# EAGLE design Grove - Barometer Sensor V0.9b (EAGLE 6.1)
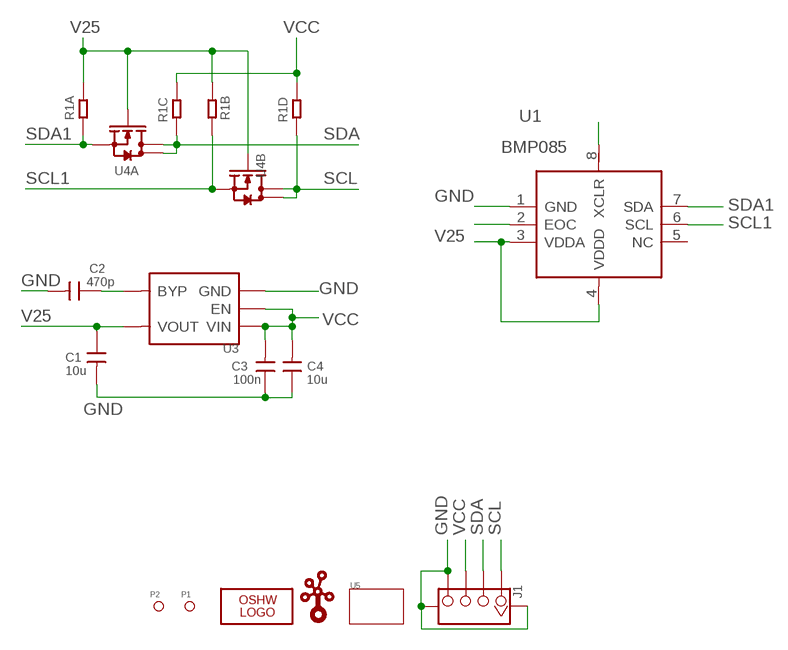
[diagram p0: schematic, sheet 1]

## Parts
C1  10u  C-0603  [0603]
C2  470p  C-0603  [0603]
C3  100n  C-0603  [0603]
C4  10u  C-0603  [0603]
J1  TWIG-4P-2.0-SMD-FEMALE-REINFORCE'DD'  [4P-SMD-2.0]
LOGO2  LOGO-OSHW-FILLX0200-NT  [OSHW_FILLX200_NOTEXT]
P1  PAD-MARK  [ROUND-MARK-0.635]
P2  PAD-MARK  [ROUND-MARK-0.635]
R1  R-4R-1206  [1206-8-3.3X2.4]
U1  BMP085  [LCC8]
U3  MIC5205  [SOT23-5]
U4  MOSFET-DUAL-N-1206-8  [1206-8]
U5  TWIG-1U  [1U-DIM-W/-DRILL]
U$1  LOGO-TWIGTWIGLOGO_SMALL  [TWIGLOGO_SMALL]

## Nets
GND: C1.2 C2.2 C3.1 C4.1 J1.4 J1.SS1 J1.SS2 U1.1(GND) U3.2(GND)
N$1: U1.2(EOC)
N$3: C2.1 U3.4(BYP)
N$4: U1.8(XCLR)
SCL: J1.1 R1.4 U4.5(B:D) U4.6(B:D)
SCL1: R1.7 U1.6(SCL) U4.3(B:S)
SDA: J1.2 R1.3 U4.7(A:D) U4.8(A:D)
SDA1: R1.1 U1.7(SDA) U4.1(A:S)
V25: C1.1 R1.2 R1.8 U1.3(VDDA) U1.4(VDDD) U3.5(VOUT) U4.2(A:G) U4.4(B:G)
VCC: C3.2 C4.2 J1.3 R1.5 R1.6 U3.1(VIN) U3.3(EN)
Unconnected: U1.5(NC)

## Library data of the parts
C1-C4 = Discrete:C*: Ceramic Capacitors
J1 = Connector:TWIG-4P-2.0-SMD-FEMALE-REINFORCE
LOGO2 = Logo:LOGO-OSHW-FILL
P1 P2 = Discrete:PAD-MARK
R1 = Discrete:R-4R*: Resistor Array
U1 = IC:BMP085: Digital pressure sensor http://www.bosch-sensortec.com/content/language4/downloads/BST-BMP085-DS000-06.pdf
U3 = IC:MIC5205: The MIC5205 is an efficient linear voltage regulator with ultra-low-noise output, very low dropout voltage (typically 17mV at light loads and 165mV at 150mA), and very low ground current (600µA at 100mA output). The MIC5205 offers better than 1% initial accuracy. datasheet here: http://www.micrel.com/product-info/prod/5205.shtml
U4 = Discrete:MOSFET-DUAL-N: Si5902BDC/Si5904DC/Si5908DC/Si5920DC
U5 = Module:TWIG
U$1 = Logo:LOGO-TWIG

## Board
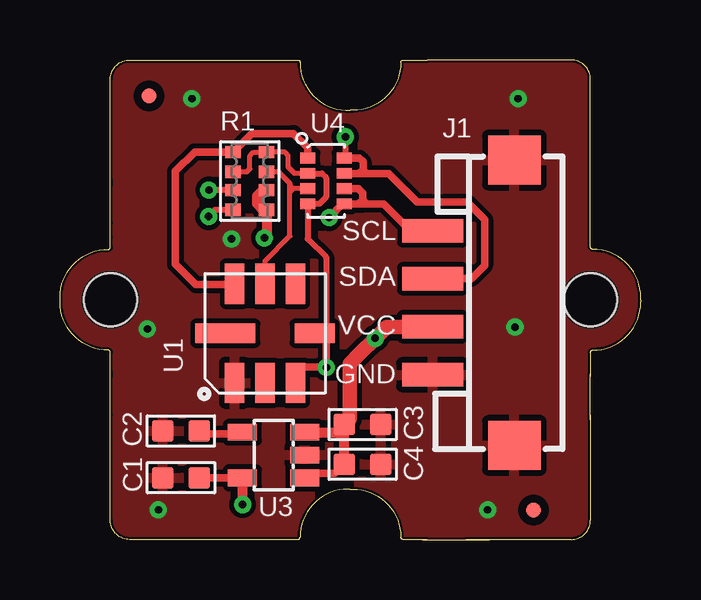
[diagram p1: board, top side]
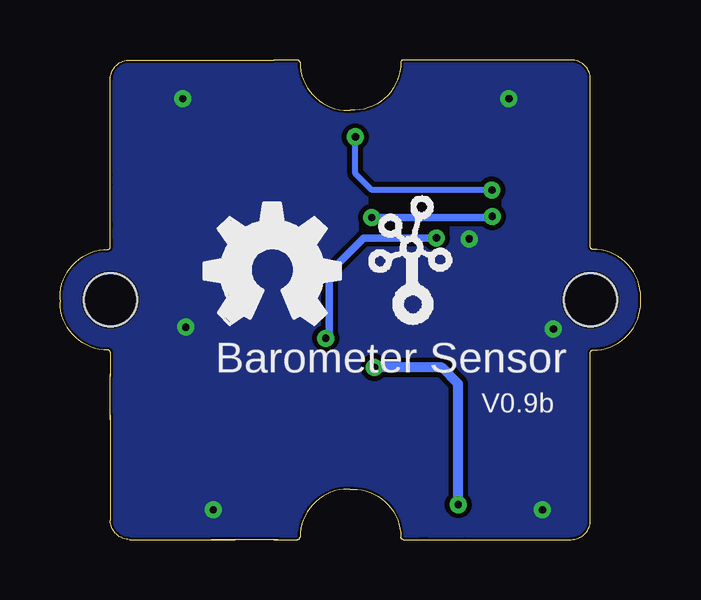
[diagram p2: board, bottom side, seen from below]

Size 24.2 x 20 mm. Coordinates in mm from the lower left corner, seen from the top.
Copper layers (1*16): Top 0.035mm / dielectric 1.5mm / Bottom 0.035mm
Design rules: minimum track width 6mil, minimum drill 12mil, track to track 8mil, track to pad 8mil, pad to pad 8mil, via to via 8mil, smd to smd 0mil, copper to edge 4mil, drill to drill 8mil, minimum pad ring 10mil, minimum via ring 8mil, stop-mask expansion 4mil, vias tented up to drill 25mil, thermal gap 10mil

### Footprints (pad centres in the part's own frame; a part is rotated, then mirrored left to right if it is on the bottom)
0603 = smd 0.889 x 0.889: 1 -0.762,0; 2 0.762,0
4P-SMD-2.0 = smd 0.965 x 2.54: 1 -3,0; 2 -1,0; 3 1,0; 4 3,0 | smd 2.032 x 2.184: SS1 -5.946,3.4; SS2 5.946,3.4
ROUND-MARK-0.635 = smd 0.635 x 0.635: P$1 0,0
1206-8-3.3X2.4 = smd 0.508 x 0.635: 1 -1.206,-0.699; 2 -0.381,-0.699; 3 0.381,-0.699; 4 1.206,-0.699; 5 1.206,0.699; 6 0.381,0.699; 7 -0.381,0.699; 8 -1.206,0.699
LCC8 = smd 1.67 x 0.8: 1 -2.065,1.27; 2 -2.065,0; 3 -2.065,-1.27; 5 2.065,-1.27; 6 2.065,0; 7 2.065,1.27 | smd 0.8 x 1.67: 4 0,-2.065 | smd 0.8 x 2.5: 8 0,1.65
SOT23-5 = smd 0.69 x 1.2: 1 -0.95,-1.3; 2 0,-1.3; 3 0.95,-1.3; 4 0.95,1.3; 5 -0.95,1.3
1206-8 = smd 0.457 x 0.635: 1 -0.953,-0.762; 2 -0.318,-0.762; 3 0.318,-0.762; 4 0.953,-0.762; 5 0.953,0.762; 6 0.318,0.762; 7 -0.318,0.762; 8 -0.953,0.762
1U-DIM-W/-DRILL = hole 2.2: 0,-10; 0,10

### Placement (x,y rotation side)
C1  5.04,2.58 180 top
C2  5.04,4.52 180 top
C3  12.61,4.79 180 top
C4  12.61,3.14 180 top
J1  15.53,9.87 270 top
LOGO2  18.2,8.96 0 bottom
P1  3.72,18.51 0 top
P2  19.72,1.24 0 top
R1  7.91,14.95 270 top
U1  8.54,8.6 90 top
U3  8.9,3.52 90 top
U4  11.08,14.95 270 top
U5  12.1,10 90 top
U$1  11.74,8.83 0 bottom

### Tracks (layer width: path | path; a pad name or v marks a point on that pad's centre or on a via)
GND  (via drill 0.3)
  other vias: 5.5,18.38 19.09,18.38 17.81,1.24 4.1,1.24 7.15,12.54 3.64,8.78 18.96,8.86
  pour Top: -0.47,22.45 24.93,22.45 24.93,-2.95 -0.47,-2.95
  pour Bottom: -0.47,22.45 24.93,22.45 24.93,-2.95 -0.47,-2.95
N$3
  Top 0.305: C2.1 5.91,4.41 7.66,4.41 | 7.78,4.41 7.66,4.41 | U3.4 7.66,4.42 7.66,4.41
  Top 0.406: U3.4 7.6,4.35
SCL  (via drill 0.3)
  Top 0.254: R1.4 6.46,13.75 v6.19,13.48 | 11.8,13.99 U4.5 11.86,13.98
  Top 0.305: 11.8,13.99 11.77,13.99 v11.21,13.43 | J1.1 14.61,12.87 13.5,13.99 12.61,13.99 | 12.61,13.99 11.86,13.99 U4.5 | U4.6 12.42,14.64 12.61,14.45 12.61,14.17 | 12.61,14.17 12.61,13.99 | 12.61,14.17 12.46,14.01 | 12.61,14.17 12.76,14.01
  Bottom 0.254: v6.19,13.48
  Bottom 0.305: v11.21,13.43 6.24,13.43 v6.19,13.48
SCL1
  Top 0.203: 10.23,14.73 U4.3 9.71,14.64 | U1.6 8.54,11.62 9.57,12.65 9.57,14.5 | 9.57,14.5 9.57,14.86 9.1,15.33 R1.7 | 9.71,14.64 9.57,14.5 | 9.71,14.64 9.7,14.64 9.61,14.72
SDA  (via drill 0.3)
  Top 0.254: R1.3 v6.21,14.57 | v11.89,16.79 11.89,15.93 11.82,15.86 11.82,15.88 U4.8
  Top 0.305: J1.2 16.53,10.87 16.55,10.89 | 16.55,10.89 17.15,10.89 17.69,11.43 17.69,13.35 16.97,14.06 14.89,14.06 13.7,15.26 12.63,15.26 | U4.7 11.86,15.26 12.46,15.26 | 12.46,15.26 12.63,15.26 | 15.15,10.89 16.55,10.89 | U4.8 12.48,15.91 12.63,15.75 12.63,15.44 | 12.63,15.41 12.63,15.26 | 12.63,15.44 12.63,15.41 | 12.63,15.41 12.76,15.28 | 12.63,15.44 12.46,15.26
  Bottom 0.254: v6.21,14.57 11.21,14.57 11.89,15.26 v11.89,16.79
SDA1
  Top 0.305: U1.7 7.27,10.63 5.66,10.63 4.81,11.48 4.81,15.36 5.61,16.16 R1.1 7.98,16.93 9.73,16.93 10.32,16.34 U4.1
V25  (via drill 0.3)
  Top 0.203: R1.8 8.48,16.16 | R1.2 7.78,15.33 7.91,15.46 7.91,15.99 8.06,16.15 8.59,16.15 R1.8 | R1.8 8.62,16.15 9.38,16.15 9.51,16.02 9.51,15.54 9.78,15.27 U4.2
  Top 0.254: 11.08,8.6 11.08,11.78 10.32,12.54 U4.4 10.8,14 11.09,14.29 11.09,15.09 10.91,15.27 U4.2
  Top 0.305: U1.4 11.08,8.6 11.08,7.2 | 11.08,7.2 v11.1,7.18 | 11.08,7.2 9.93,7.2 9.69,6.95 9.69,6.7 9.81,6.57 U1.3 | C1.1 U3.5
  Top 0.406: U3.5 7.6,1.46 v7.61,1.46 | v11.1,7.18
  Bottom 0.406: v7.61,1.46 7.61,6.5 8.28,7.18 v11.1,7.18
VCC  (via drill 0.3)
  Top 0.305: U3.1 10.39,2.76 11.44,2.76 11.85,3.17 | 11.85,3.17 C4.2 | C4.2 11.85,2.89 | 11.85,3.17 arc60 C4.2
  Top 0.406: v8.52,12.58 8.52,12.59 8.52,12.6 8.61,12.69 R1.5 8.46,13.75 8.21,13.99 8.21,14.34 8.45,14.57 R1.6 | U3.3 11.53,4.47 | 11.53,4.47 C3.2 11.85,4.16 | 11.85,3.17 11.85,4.16 | 11.53,4.47 11.85,4.16
  Top 0.61: J1.3 13.61,8.87 v13.13,8.39 12.5,7.76 12.07,7.33 12.07,5.02 C3.2
  Bottom 0.305: v8.52,12.58 11.55,12.58 12.99,11.14 12.99,8.53 v13.13,8.39

### Text on the board
tPlace: SCL | SDA | VCC | GND
bPlace: Barometer Sensor | V0.9b